# Altium project DC_DC_Convertor.PrjPcb
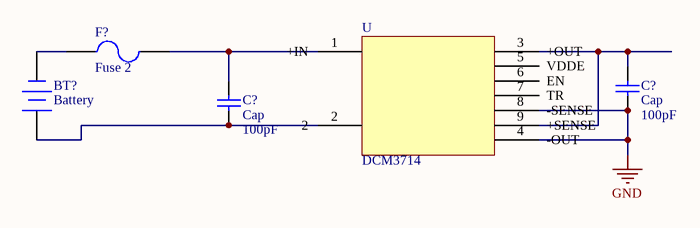
[diagram p0: PCMCIA Type 2 Shielded 33 Pin IO Connector.schdoc]
1 sheet, 5 parts. Net scope: global (net labels, ports and power ports of the same name join across sheets).
Board file: PCMCIA Type 2 Shielded 33 Pin IO Connector.PCBDOC

## Sheet PCMCIA Type 2 Shielded 33 Pin IO Connector.schdoc: PCMCIA Type 2 Shielded 33 Pin IO Connector
size A; Organization: Organization; Address1: Address1; Address2: Address2; Address3: Address3; Address4: Address4; DocumentNumber: 1; Revision: 0; SheetNumber: 2; SheetTotal: 2

### Parts
(Parts that share a designator on the sheet are numbered #1, #2 ... from top to bottom, then left to right.)
BT?  Battery  [BAT-2]
C?#1  Cap  value 100pF  [RAD-0.3]
C?#2  Cap  value 100pF  [RAD-0.3]
F?  Fuse 2  [PIN-W2/E2.8]
U  DCM3714

### Nets
GND: C?#1.1
NetBT?_1: BT?.1(+) C?#2.1
NetBT?_2: BT?.2(-) F?.1
NetC?#2_2: C?#2.2 F?.2

Not connected (* = marked no-connect by the designer): C?#1 2; U 1(+IN) 2 3(+OUT) 4(-OUT) 5(VDDE) 6(EN) 7(TR) 8(-SENSE) 9(+SENSE)

### Library data of the parts
BT? = Battery: Multicell Battery; Published: 24-Mar-1999; LatestRevisionDate: 17-Jul-2002; LatestRevisionNote: Re-released for DXP Platform.; PackageReference: BAT-2; Publisher: Altium Limited; PackageDescription: Battery; 2 Leads
C?#1 C?#2 = Cap: Capacitor; Published: 8-Jun-2000; LatestRevisionDate: 17-Jul-2002; LatestRevisionNote: Re-released for DXP Platform.; PackageReference: RAD-0.3; Publisher: Altium Limited; PackageDescription: Radial Cap, Thru-Hole; 2 Leads; 0.3 in Pin Spacing
F? = Fuse 2: Fuse; Published: 8-Jun-2000; LatestRevisionDate: 17-Jul-2002; LatestRevisionNote: Re-released for DXP Platform.; PackageReference: PIN-W2/E2.8; Publisher: Altium Limited; PackageDescription: Thru-Hole; 2 Leads